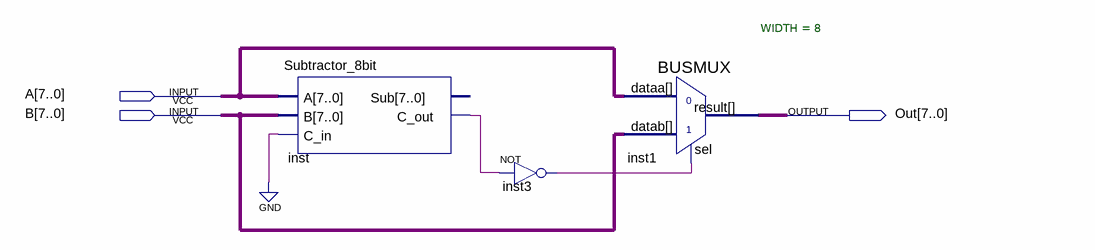
[diagram p0: schematic sheet]
// Quartus schematic Min_8bit.bdf as structural Verilog: 3 symbols, 3 pins
module Min_8bit (
  input  [7:0] A,
  input  [7:0] B,
  output [7:0] Out
);

  wire inst3_out, inst_c_out;

  Subtractor_8bit inst (.A(A), .B(B), .C_in(1'b0), .C_out(inst_c_out));  // open: Sub
  not inst3 (inst3_out, inst_c_out);
  BUSMUX #(.WIDTH(8)) inst1 (.datab(B), .sel(inst3_out), .dataa(A), .result(Out));
endmodule
